# EAGLE schematic protoboard_demo.v1.1 (EAGLE 5.07)
PROJECT: Protoboard v1.1 (.800 xQFP)
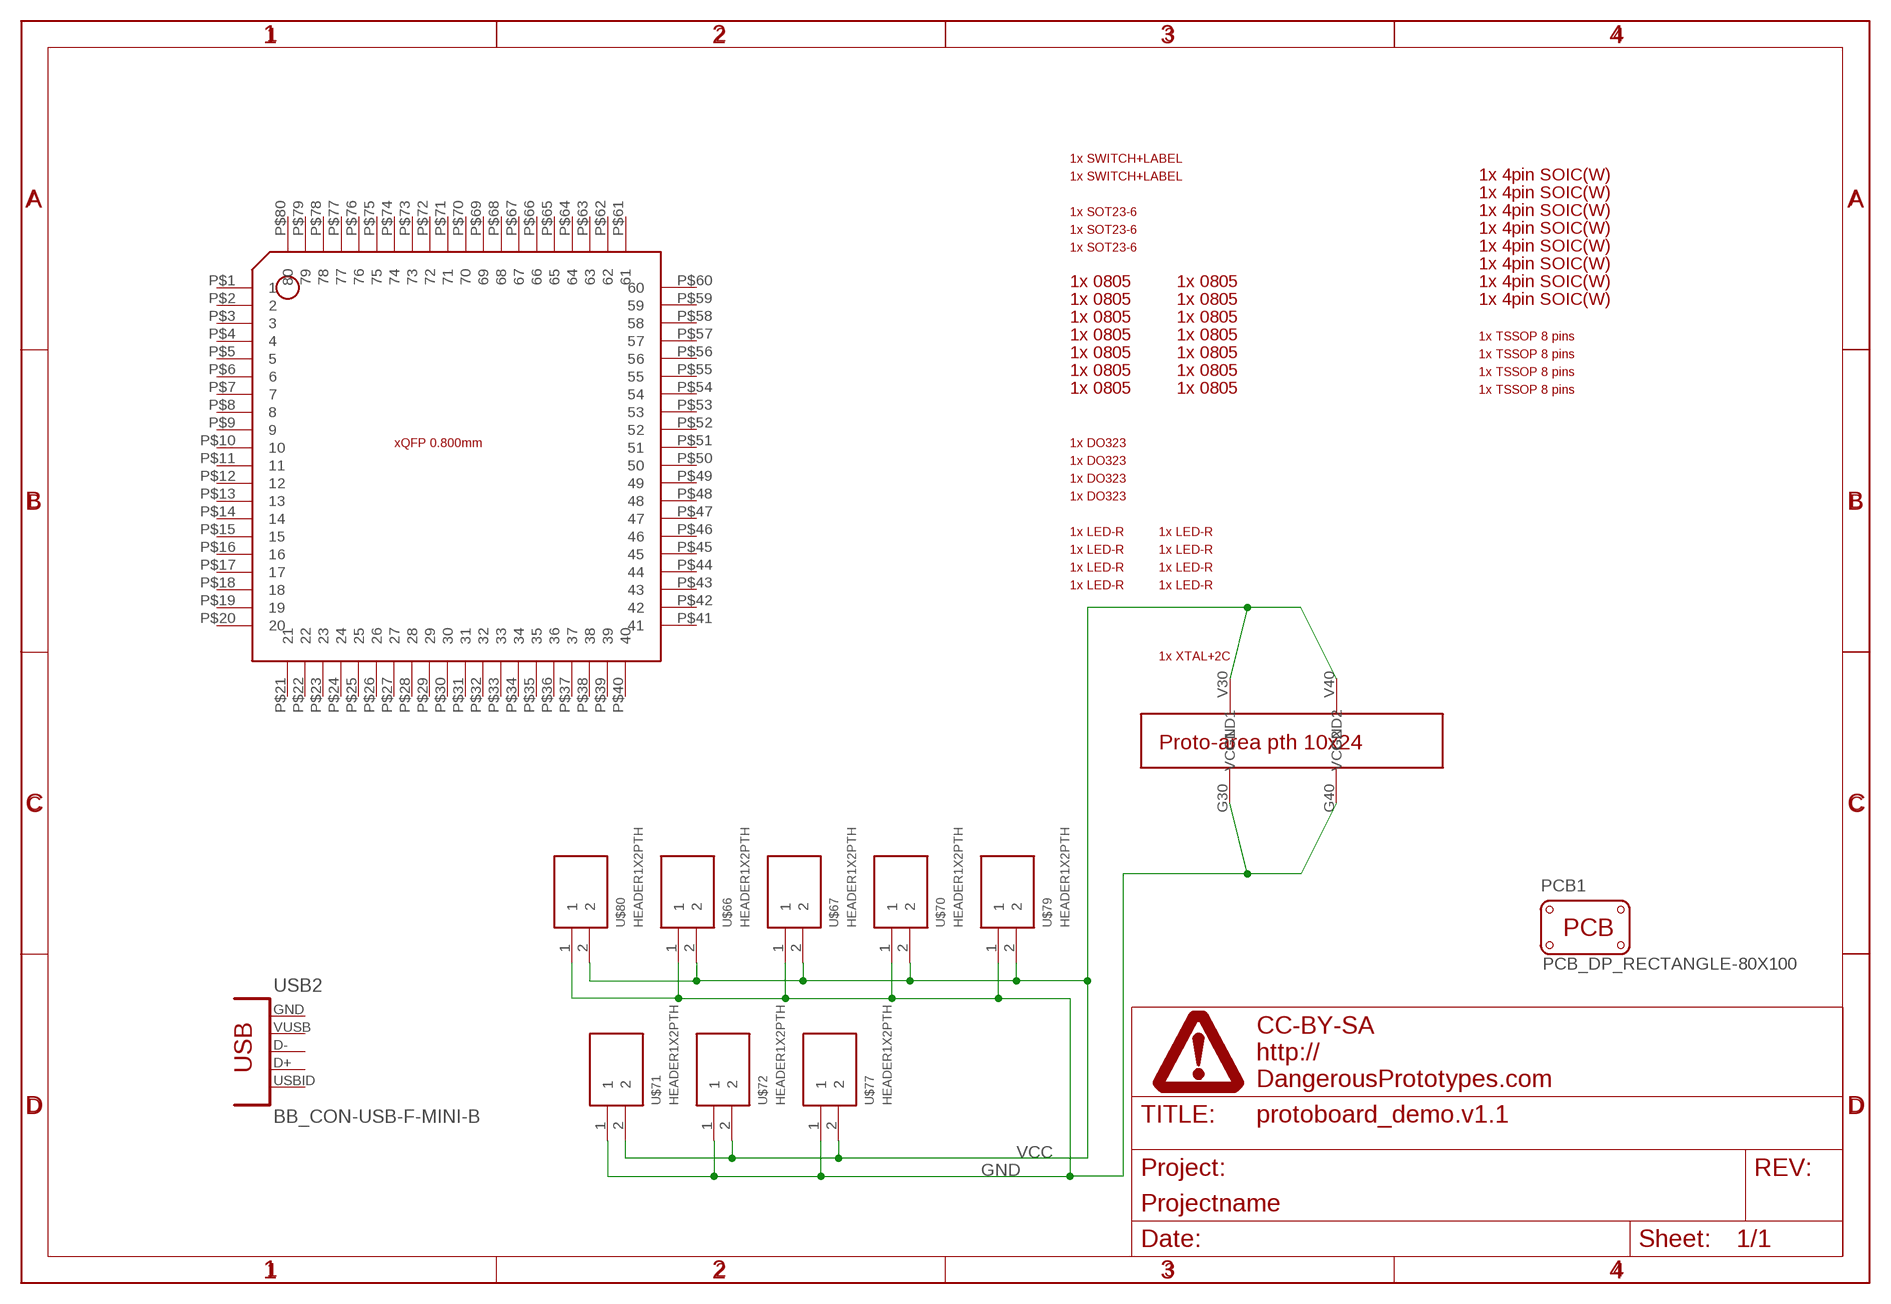
[diagram p0: schematic, sheet 1]

## Parts
PCB1  PCB_DP_RECTANGLE-80X100  [DP10080_V1]
U$1  DINA4_L  [DP_LOGO]
U$2  BB_SOICW  [BB_SOIC]
U$3  BB_SOICW  [BB_SOIC]
U$4  BB_SOICW  [BB_SOIC]
U$5  BB_SOICW  [BB_SOIC]
U$6  BB_SOICW  [BB_SOIC]
U$7  BB_SOICW  [BB_SOIC]
U$8  BB_SOICW  [BB_SOIC]
U$9  BB_SOICW  [BB_SOIC]
U$10  BB_TSSOP_065  [BB_TSSOP_0650]
U$11  BB_TSSOP_065  [BB_TSSOP_0650]
U$12  BB_TSSOP_065  [BB_TSSOP_0650]
U$13  BB_TSSOP_065  [BB_TSSOP_0650]
U$14  BB_SW  [BB_SW]
U$15  BB_SW  [BB_SW]
U$18  BB_SOT23-6  [BB_SOT23-6]
U$19  BB_SOT23-6  [BB_SOT23-6]
U$20  PROTO_10X24  [PROTO_10_24]
U$21  BB_RC0805  [BB_RC0805]
U$22  BB_RC0805  [BB_RC0805]
U$23  BB_RC0805  [BB_RC0805]
U$24  BB_RC0805  [BB_RC0805]
U$25  BB_RC0805  [BB_RC0805]
U$26  BB_RC0805  [BB_RC0805]
U$28  BB_LED  [BB_LED]
U$29  BB_LED  [BB_LED]
U$30  BB_LED  [BB_LED]
U$31  BB_LED  [BB_LED]
U$35  BB_DO323  [BB_DO323]
U$36  BB_DO323  [BB_DO323]
U$37  BB_DO323  [BB_DO323]
U$39  BB_DO323  [BB_DO323]
U$40  BB_XTAL  [BB_XTAL]
U$41  BB_RC0805  [BB_RC0805]
U$42  BB_XQFP_080BB  [BB_QFP_080_BREAKOUT_BOARD]
U$44  BB_SOT23-6  [BB_SOT23-6]
U$45  BB_LED  [BB_LED]
U$46  BB_LED  [BB_LED]
U$47  BB_LED  [BB_LED]
U$48  BB_LED  [BB_LED]
U$54  BB_RC0805  [BB_RC0805]
U$55  BB_RC0805  [BB_RC0805]
U$57  BB_RC0805  [BB_RC0805]
U$58  BB_RC0805  [BB_RC0805]
U$59  BB_RC0805  [BB_RC0805]
U$61  BB_RC0805  [BB_RC0805]
U$62  BB_RC0805  [BB_RC0805]
U$66  HEADER1X2PTH  [M1X2]
U$67  HEADER1X2PTH  [M1X2]
U$70  HEADER1X2PTH  [M1X2]
U$71  HEADER1X2PTH  [M1X2]
U$72  HEADER1X2PTH  [M1X2]
U$77  HEADER1X2PTH  [M1X2]
U$79  HEADER1X2PTH  [M1X2]
U$80  HEADER1X2PTH  [M1X2]
USB2  BB_CON-USB-F-MINI-B  [BB_CONN_USB_MINI-B]

## Nets
GND: U$20.G30(GND1) U$20.G40(GND2) U$66.1 U$67.1 U$70.1 U$71.1 U$72.1 U$77.1 U$79.1 U$80.1
VCC: U$20.V30(VCC1) U$20.V40(VCC2) U$66.2 U$67.2 U$70.2 U$71.2 U$72.2 U$77.2 U$79.2 U$80.2
Unconnected: U$42.P$1 U$42.P$2 U$42.P$3 U$42.P$4 U$42.P$5 U$42.P$6 U$42.P$7 U$42.P$8 U$42.P$9 U$42.P$10 U$42.P$11 U$42.P$12 U$42.P$13 U$42.P$14 U$42.P$15 U$42.P$16 U$42.P$17 U$42.P$18 U$42.P$19 U$42.P$20 U$42.P$21 U$42.P$22 U$42.P$23 U$42.P$24 U$42.P$25 U$42.P$26 U$42.P$27 U$42.P$28 U$42.P$29 U$42.P$30 U$42.P$31 U$42.P$32 U$42.P$33 U$42.P$34 U$42.P$35 U$42.P$36 U$42.P$37 U$42.P$38 U$42.P$39 U$42.P$40 U$42.P$41 U$42.P$42 U$42.P$43 U$42.P$44 U$42.P$45 U$42.P$46 U$42.P$47 U$42.P$48 U$42.P$49 U$42.P$50 U$42.P$51 U$42.P$52 U$42.P$53 U$42.P$54 U$42.P$55 U$42.P$56 U$42.P$57 U$42.P$58 U$42.P$59 U$42.P$60 U$42.P$61 U$42.P$62 U$42.P$63 U$42.P$64 U$42.P$65 U$42.P$66 U$42.P$67 U$42.P$68 U$42.P$69 U$42.P$70 U$42.P$71 U$42.P$72 U$42.P$73 U$42.P$74 U$42.P$75 U$42.P$76 U$42.P$77 U$42.P$78 U$42.P$79 U$42.P$80 USB2.BODY@1(BODY) USB2.BODY@2(BODY) USB2.BODY@3(BODY) USB2.BODY@4(BODY) USB2.D+ USB2.D- USB2.GND USB2.ID(USBID) USB2.VUSB

## Library data of the parts
PCB1 = dp_devices:PCB_DP_RECTANGLE: Dangerous Prototypes Standard Rectangular PCB sizes
U$1 = dp_devices:DINA4_L: A4 DP frame Standard Dangerous Prototypes schematic frame. Automagically adds the DP logo and standard texts to the PCB Use the atrribute in the schematic editor to change the fields.; FF1: fulfillment by; FF2: Seeed Studio; FF3: www.seeedstudio.com; LICENSE: CC-BY-SA; PROJECT: Projectname; URL1: http://; URL2: DangerousPrototypes.com
U$2-U$9 = DP_protoboard:BB_SOICW
U$10-U$13 = DP_protoboard:BB_TSSOP_065: Use grid 0.650mm to place!
U$14 U$15 = DP_protoboard:BB_SW
U$18 U$19 U$44 = DP_protoboard:BB_SOT23-6
U$20 = DP_protoboard:PROTO_10X24
U$21-U$26 U$41 U$54 U$55 U$57-U$59 U$61 U$62 = DP_protoboard:BB_RC0805
U$28-U$31 U$45-U$48 = DP_protoboard:BB_LED
U$35-U$37 U$39 = DP_protoboard:BB_DO323
U$40 = DP_protoboard:BB_XTAL
U$42 = dp_devices:BB_XQFP_080
U$66 U$67 U$70-U$72 U$77 U$79 U$80 = dp_devices:HEADER1X2
USB2 = DP_protoboard:BB_CON-USB-F: USB Female connector